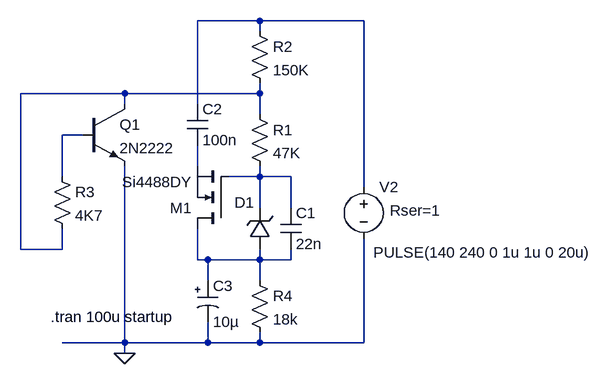
[diagram p0: schematic GoldStar1465DL_H.asc]
GoldStar1465DL_H.asc, the LTspice schematic file:
Version 4
SHEET 1 880 680
WIRE -256 352 -256 112
WIRE -192 240 -192 176
WIRE -192 352 -256 352
WIRE -192 352 -192 320
WIRE -160 176 -192 176
WIRE -96 112 -256 112
WIRE -96 128 -96 112
WIRE -96 496 -192 496
WIRE -96 496 -96 224
WIRE -96 512 -96 496
WIRE 16 128 16 0
WIRE 16 224 16 192
WIRE 16 368 16 320
WIRE 32 368 16 368
WIRE 32 400 32 368
WIRE 32 496 -96 496
WIRE 32 496 32 464
WIRE 112 0 16 0
WIRE 112 16 112 0
WIRE 112 112 -96 112
WIRE 112 112 112 96
WIRE 112 144 112 112
WIRE 112 240 64 240
WIRE 112 240 112 224
WIRE 112 288 112 240
WIRE 112 368 32 368
WIRE 112 368 112 352
WIRE 112 400 112 368
WIRE 112 496 32 496
WIRE 112 496 112 480
WIRE 160 240 112 240
WIRE 160 288 160 240
WIRE 160 368 112 368
WIRE 160 368 160 352
WIRE 272 0 112 0
WIRE 272 256 272 0
WIRE 272 496 112 496
WIRE 272 496 272 336
FLAG -96 512 0
SYMBOL nmos 64 320 R180
SYMATTR InstName M1
SYMATTR Value Si4488DY
SYMBOL zener 128 352 R180
WINDOW 0 24 72 Left 0
WINDOW 3 24 0 Invisible 0
SYMATTR InstName D1
SYMATTR Value BZX84C10L
SYMATTR Description Diode
SYMATTR Type diode
SYMBOL cap 144 288 R0
SYMATTR InstName C1
SYMATTR Value 22n
SYMBOL res 96 128 R0
SYMATTR InstName R1
SYMATTR Value 47K
SYMATTR SpiceLine tol=1 pwr=0.1
SYMBOL res 96 0 R0
SYMATTR InstName R2
SYMATTR Value 150K
SYMATTR SpiceLine tol=1 pwr=0.1
SYMBOL npn2 -160 128 R0
SYMATTR InstName Q1
SYMATTR Value 2N2222
SYMBOL cap 0 128 R0
SYMATTR InstName C2
SYMATTR Value 100n
SYMBOL voltage 272 240 R0
WINDOW 3 15 117 Left 0
WINDOW 123 0 0 Left 0
WINDOW 39 40 52 Left 0
SYMATTR InstName V2
SYMATTR Value PULSE(140 240 0 1u 1u 0 20u)
SYMATTR SpiceLine Rser=1
SYMBOL res -208 224 R0
SYMATTR InstName R3
SYMATTR Value 4K7
SYMATTR SpiceLine tol=1 pwr=0.1
SYMBOL res 96 384 R0
SYMATTR InstName R4
SYMATTR Value 18k
SYMATTR SpiceLine tol=1 pwr=0.1
SYMBOL polcap 16 400 R0
WINDOW 3 24 64 Left 0
SYMATTR InstName C3
SYMATTR Value 10µ
SYMATTR Description Capacitor
SYMATTR Type cap
SYMATTR SpiceLine V=63 Irms=170m Rser=1 MTBF=5000 Lser=0 mfg="Nichicon" pn="UPG1J100MPH" type="Al electrolytic" ppPkg=1
TEXT -210 456 Left 0 !.tran 100u startup

The netlist it stands for:
* GoldStar1465DL_H.asc
M1 N005 N006 N004 N004 Si4488DY
D1 N005 N006 BZX84C10L
C1 N006 N005 22n
R1 N001 N006 47K tol=1 pwr=0.1
R2 N003 N001 150K tol=1 pwr=0.1
Q1 N001 N002 0 0 2N2222
C2 N003 N004 100n
V2 N003 0 PULSE(140 240 0 1u 1u 0 20u) Rser=1
R3 N002 N001 4K7 tol=1 pwr=0.1
R4 N005 0 18k tol=1 pwr=0.1
C3 N005 0 10µ V=63 Irms=170m Rser=1 MTBF=5000 Lser=0 mfg="Nichicon" pn="UPG1J100MPH" type="Al electrolytic" ppPkg=1
.model D D
.lib standard.dio
.model NPN NPN
.model PNP PNP
.lib standard.bjt
.model NMOS NMOS
.model PMOS PMOS
.lib standard.mos
.tran 100u startup
.backanno
.end